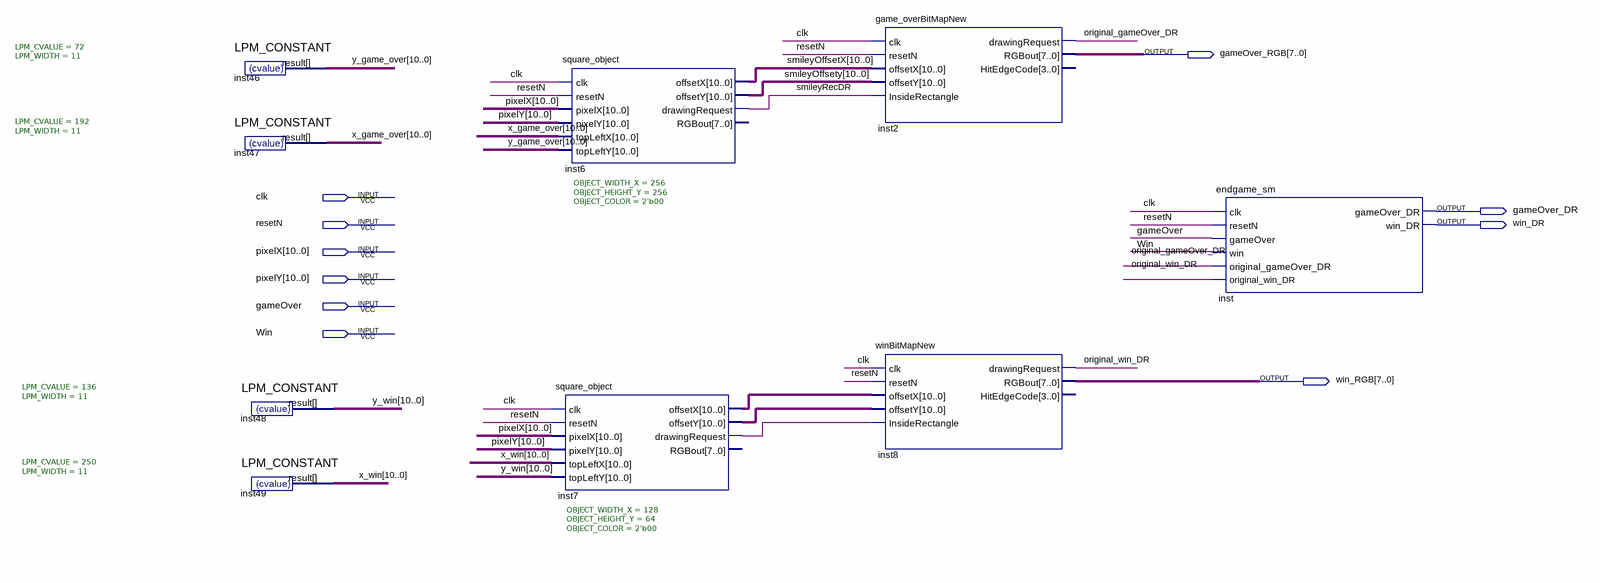
[diagram p0: schematic sheet]
// Quartus schematic endgame_block.bdf as structural Verilog: 9 symbols, 10 pins
module endgame_block (
  input  clk,
  input  resetN,
  input  [10:0] pixelX,
  input  [10:0] pixelY,
  input  gameOver,
  input  Win,
  output [7:0] gameOver_RGB,
  output gameOver_DR,
  output win_DR,
  output [7:0] win_RGB
);

  wire inst7_drawingrequest, original_gameOver_DR, original_win_DR, smileyRecDR;
  wire [10:0] inst7_offsetx, inst7_offsety, smileyOffsetX, smileyOffsety, x_game_over, x_win, y_game_over,
       y_win;

  LPM_CONSTANT #(.LPM_CVALUE(72), .LPM_WIDTH(11)) inst46 (.result(y_game_over));
  LPM_CONSTANT #(.LPM_CVALUE(192), .LPM_WIDTH(11)) inst47 (.result(x_game_over));
  LPM_CONSTANT #(.LPM_CVALUE(136), .LPM_WIDTH(11)) inst48 (.result(y_win));
  LPM_CONSTANT #(.LPM_CVALUE(250), .LPM_WIDTH(11)) inst49 (.result(x_win));
  square_object #(.OBJECT_WIDTH_X(256), .OBJECT_HEIGHT_Y(256), .OBJECT_COLOR(2'b00)) inst6 (
    .clk(clk), .resetN(resetN), .pixelX(pixelX), .pixelY(pixelY), .topLeftX(x_game_over),
    .topLeftY(y_game_over), .offsetX(smileyOffsetX), .offsetY(smileyOffsety), .drawingRequest(smileyRecDR));  // open: RGBout
  square_object #(.OBJECT_WIDTH_X(128), .OBJECT_HEIGHT_Y(64), .OBJECT_COLOR(2'b00)) inst7 (
    .clk(clk), .resetN(resetN), .pixelX(pixelX), .pixelY(pixelY), .topLeftX(x_win), .topLeftY(y_win),
    .offsetX(inst7_offsetx), .offsetY(inst7_offsety), .drawingRequest(inst7_drawingrequest));  // open: RGBout
  game_overBitMapNew inst2 (
    .clk(clk), .resetN(resetN), .offsetX(smileyOffsetX), .offsetY(smileyOffsety),
    .InsideRectangle(smileyRecDR), .drawingRequest(original_gameOver_DR), .RGBout(gameOver_RGB));  // open: HitEdgeCode
  winBitMapNew inst8 (
    .clk(clk), .resetN(resetN), .offsetX(inst7_offsetx), .offsetY(inst7_offsety),
    .InsideRectangle(inst7_drawingrequest), .drawingRequest(original_win_DR), .RGBout(win_RGB));  // open: HitEdgeCode
  endgame_sm inst (
    .clk(clk), .resetN(resetN), .gameOver(gameOver), .win(Win), .original_gameOver_DR(original_gameOver_DR),
    .original_win_DR(original_win_DR), .gameOver_DR(gameOver_DR), .win_DR(win_DR));
endmodule
